# Altium project 003.sensor.PrjPcb
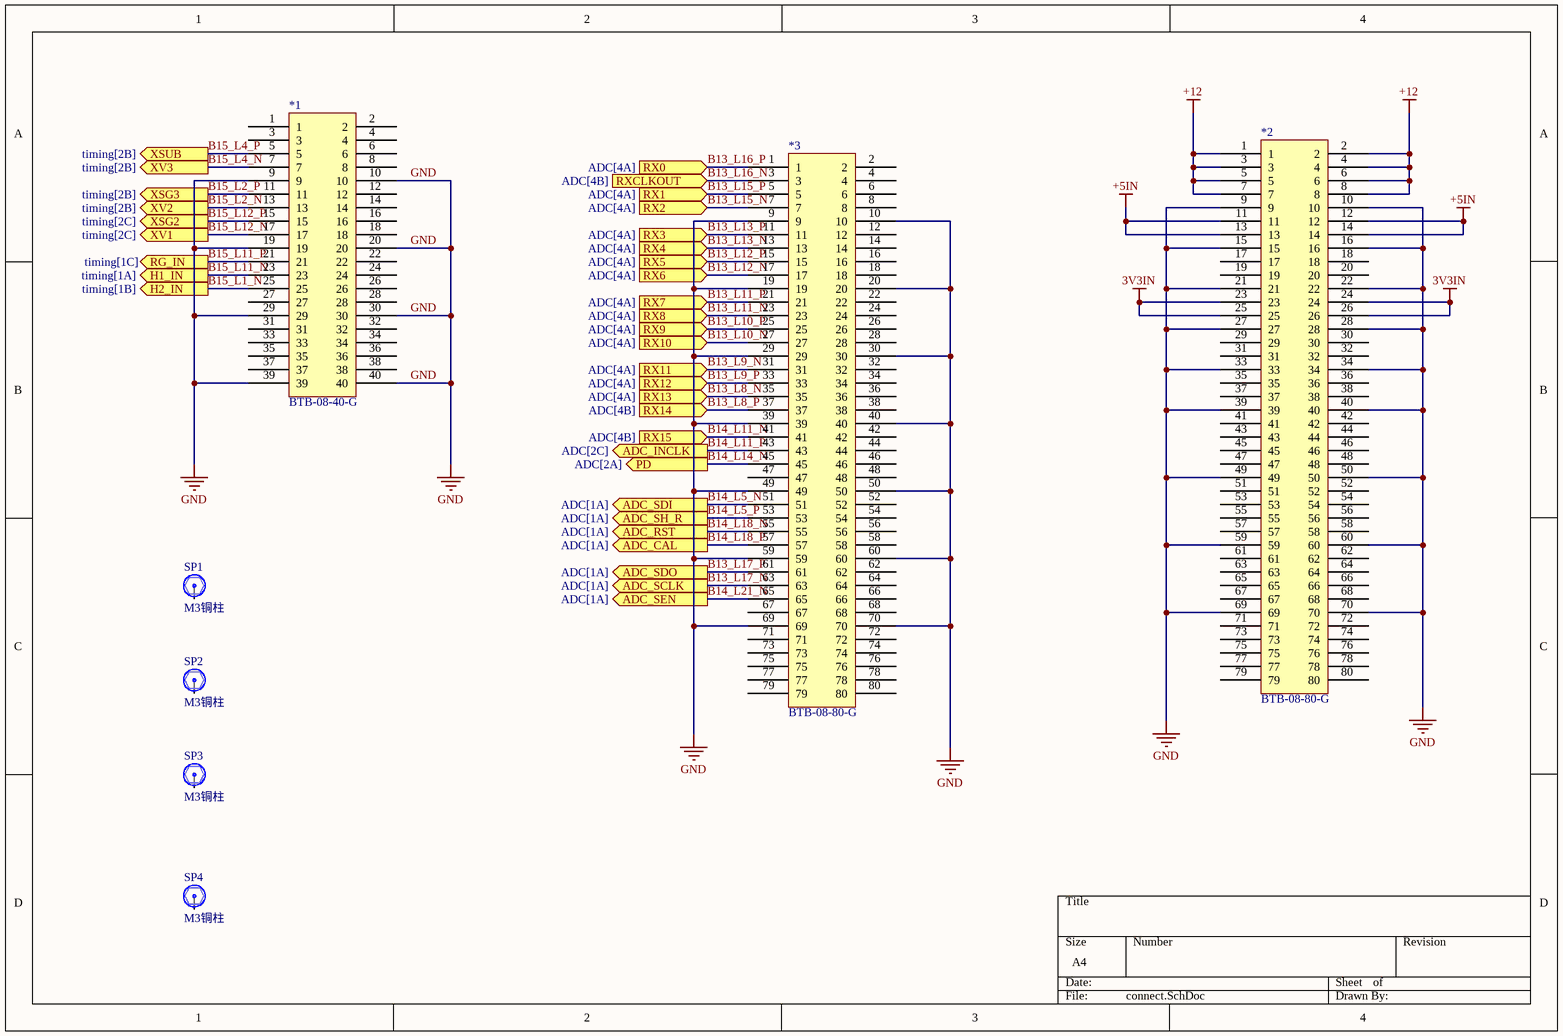
[diagram p0: connect.SchDoc]
5 sheets, 159 parts. Net scope: flat (ports and power ports of the same name join across sheets).
Board files: PCB2.PcbDoc, PCB1.PcbDoc
Sheets:
  connect.SchDoc
  power.SchDoc
  ADC.SchDoc
  CCD.SchDoc
  timing.SchDoc

## Sheet connect.SchDoc
size A4; SheetNumber: 1; SheetTotal: 5

### Parts
*1  BTB-08-40-G  [BTB-08-40-M]
*2  BTB-08-80-G  [BTB-08-80-G]
*3  BTB-08-80-G  [BTB-08-80-G]
SP1  M3铜柱  [M3x5_N]
SP2  M3铜柱  [M3x5_N]
SP3  M3铜柱  [M3x5_N]
SP4  M3铜柱  [M3x5_N]

### Ports
ADC_CAL (out, see ADC[1A]), ADC_INCLK (out, see ADC[2C]), ADC_RST (out, see ADC[1A]), ADC_SCLK (out, see ADC[1A]), ADC_SDI (out, see ADC[1A]), ADC_SDO (out, see ADC[1A]), ADC_SEN (out, see ADC[1A]), ADC_SH_R (out, see ADC[1A]), H1_IN (out, see timing[1A]), H2_IN (out, see timing[1B]), PD (out, see ADC[2A]), RG_IN (out, see timing[1C]), RX0 (in, see ADC[4A]), RX1 (in, see ADC[4A]), RX2 (in, see ADC[4A]), RX3 (in, see ADC[4A]), RX4 (in, see ADC[4A]), RX5 (in, see ADC[4A]), RX6 (in, see ADC[4A]), RX7 (in, see ADC[4A]), RX8 (in, see ADC[4A]), RX9 (in, see ADC[4A]), RX10 (in, see ADC[4A]), RX11 (in, see ADC[4A]), RX12 (in, see ADC[4A]), RX13 (in, see ADC[4A]), RX14 (in, see ADC[4B]), RX15 (in, see ADC[4B]), RXCLKOUT (in, see ADC[4B]), XSG2 (out, see timing[2C]), XSG3 (out, see timing[2B]), XSUB (out, see timing[2B]), XV1 (out, see timing[2C]), XV2 (out, see timing[2B]), XV3 (out, see timing[2B])

### Nets
3V3IN: *2.23 *2.24 *2.25 *2.26
+5IN: *2.11 *2.12 *2.13 *2.14
+12: *2.1 *2.2 *2.3 *2.4 *2.5 *2.6 *2.7 *2.8
GND: *1.9 *1.10 *1.19 *1.20 *1.29 *1.30 *1.39 *1.40 *2.9 *2.10 *2.15 *2.16 *2.21 *2.22 *2.27 *2.28 *2.33 *2.34 *2.39 *2.40 *2.49 *2.50 *2.59 *2.60 *2.69 *2.70 *3.9 *3.10 *3.19 *3.20 *3.29 *3.30 *3.39 *3.40 *3.49 *3.50 *3.59 *3.60 *3.69 *3.70
B13_L8_N: *3.35 ; port RX13
B13_L8_P: *3.37 ; port RX14
B13_L9_N: *3.31 ; port RX11
B13_L9_P: *3.33 ; port RX12
B13_L10_N: *3.27 ; port RX10
B13_L10_P: *3.25 ; port RX9
B13_L11_N: *3.23 ; port RX8
B13_L11_P: *3.21 ; port RX7
B13_L12_N: *3.17 ; port RX6
B13_L12_P: *3.15 ; port RX5
B13_L13_N: *3.13 ; port RX4
B13_L13_P: *3.11 ; port RX3
B13_L15_N: *3.7 ; port RX2
B13_L15_P: *3.5 ; port RX1
B13_L16_N: *3.3 ; port RXCLKOUT
B13_L16_P: *3.1 ; port RX0
B13_L17_N: *3.63 ; port ADC_SCLK  [project net ADC_SCLK]
B13_L17_P: *3.61 ; port ADC_SDO  [project net ADC_SDO]
B14_L5_N: *3.51 ; port ADC_SDI  [project net ADC_SDI]
B14_L5_P: *3.53 ; port ADC_SH_R  [project net ADC_SH_R]
B14_L11_N: *3.41 ; port RX15
B14_L11_P: *3.43 ; port ADC_INCLK  [project net ADC_INCLK]
B14_L14_N: *3.45 ; port PD
B14_L18_N: *3.55 ; port ADC_RST  [project net ADC_RST]
B14_L18_P: *3.57 ; port ADC_CAL  [project net ADC_CAL]
B14_L21_N: *3.65 ; port ADC_SEN  [project net ADC_SEN]
B15_L1_N: *1.25 ; port H2_IN
B15_L2_N: *1.13 ; port XV2
B15_L2_P: *1.11 ; port XSG3
B15_L4_N: *1.7 ; port XV3
B15_L4_P: *1.5 ; port XSUB
B15_L11_N: *1.23 ; port H1_IN
B15_L11_P: *1.21 ; port RG_IN
B15_L12_N: *1.17 ; port XV1
B15_L12_P: *1.15 ; port XSG2

Not connected (* = marked no-connect by the designer): *1 1 2 3 4 6 8 12 14 16 18 22 24 26 27 28 31 32 33 34 35 36 37 38; *2 17 18 19 20 29 30 31 32 35 36 37 38 41 42 43 44 45 46 47 48 51 52 53 54 55 56 57 58 61 62 63 64 65 66 67 68 71 72 73 74 75 76 77 78 79 80; *3 2 4 6 8 12 14 16 18 22 24 26 28 32 34 36 38 42 44 46 47 48 52 54 56 58 62 64 66 67 68 71 72 73 74 75 76 77 78 79 80; SP1 1; SP2 1; SP3 1; SP4 1

### Library data of the parts
SP1-SP4 = 铜柱大焊盘: 铜柱; 版权归属: 封装库来自淘宝 ID：黄晶宝石; BOM名称: 铜柱; 学习资源: https://shop463601444.taobao.com

## Sheet power.SchDoc
size A4; SheetNumber: 2; SheetTotal: 5
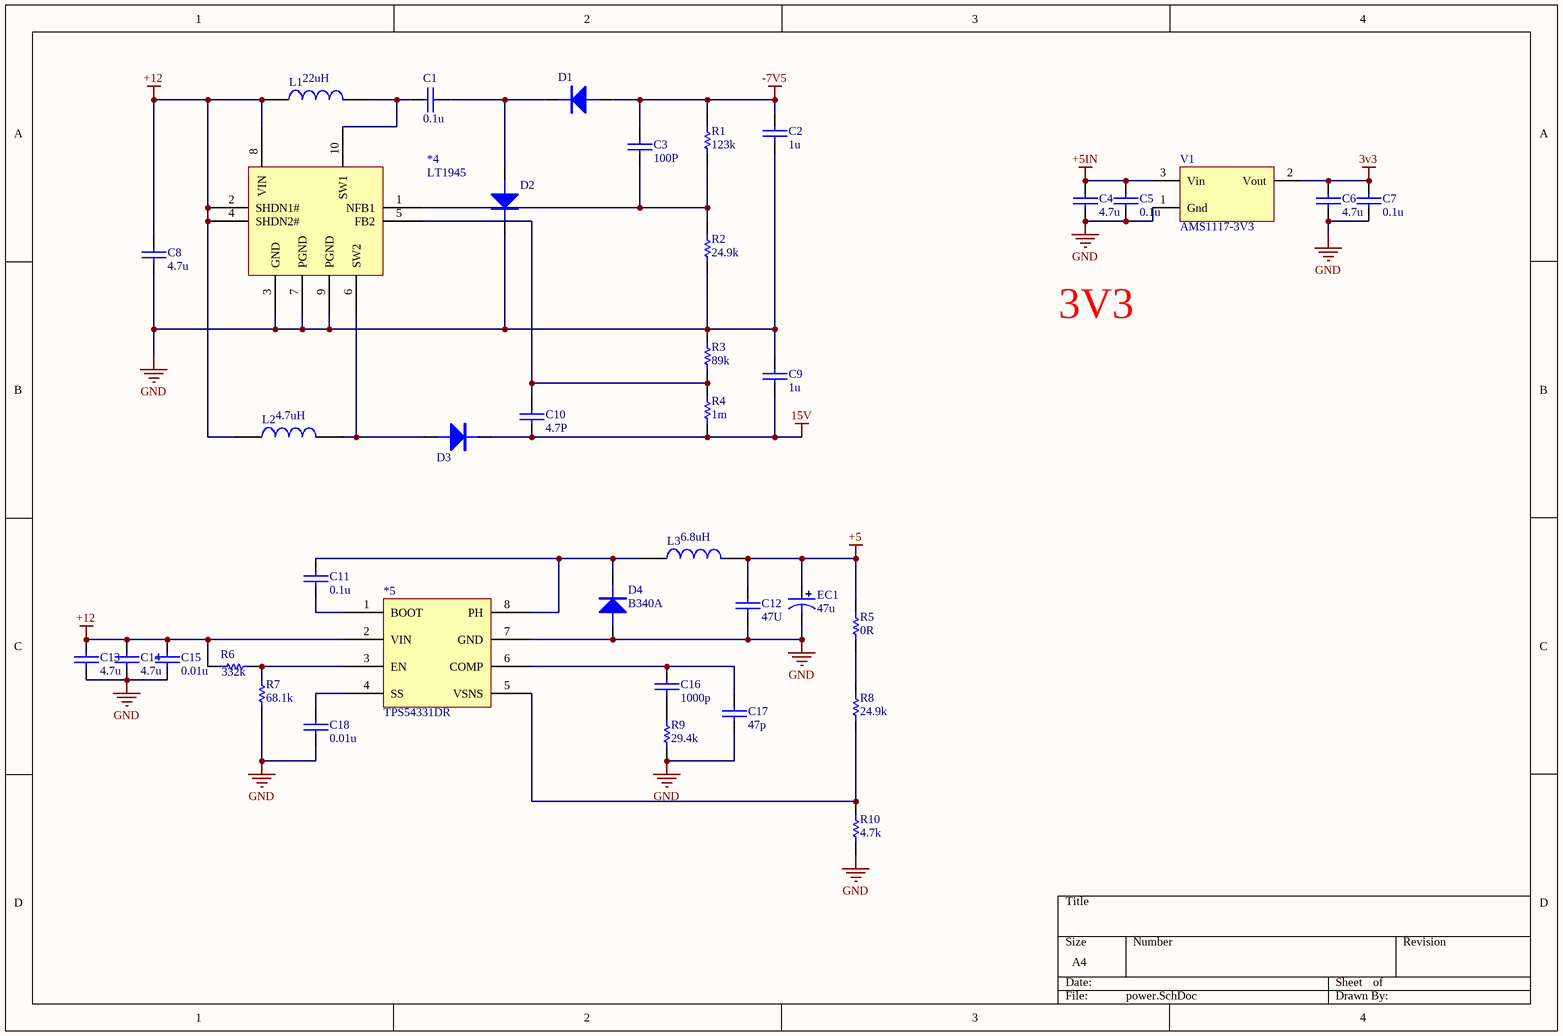
[diagram p1: power.SchDoc]

### Parts
*4  LT1945  [LT1945EMS]
*5  TPS54331DR  [SOIC-8]
C1  0.1u  [0603C]
C2  1u  [0603C]
C3  100P  [0603C]
C4  4.7u  [0603C]
C5  0.1u  [0603C]
C6  4.7u  [0603C]
C7  0.1u  [0603C]
C8  4.7u  [0603C]
C9  1u  [0603C]
C10  4.7P  [0603C]
C11  0.1u  [0603C]
C12  47U  [0603C]
C13  4.7u  [0603C]
C14  4.7u  [0603C]
C15  0.01u  [0603C]
C16  1000p  [0603C]
C17  47p  [0603C]
C18  0.01u  [0603C]
D1  B340A  [SMA/DO-214AC]  (value not drawn)
D2  B340A  [SMA/DO-214AC]  (value not drawn)
D3  B340A  [SMA/DO-214AC]  (value not drawn)
D4  B340A  [SMA/DO-214AC]
EC1  47u  [SMD-EC6.3X6.3X10]
L1  22uH  [L-SMD-0630]
L2  4.7uH  [L-SMD-0630]
L3  6.8uH  [L-SMD-0630]
R1  123k  [0603R]
R2  24.9k  [0603R]
R3  89k  [0603R]
R4  1m  [0603R]
R5  0R  [0603R]
R6  332k  [0603R]
R7  68.1k  [0603R]
R8  24.9k  [0603R]
R9  29.4k  [0603R]
R10  4.7k  [0603R]
V1  AMS1117-3V3  [SOT223_L]

### Nets
3v3: C6.2 C7.2 V1.2(Vout)
15V: C9.2 C10.2 D3.K R4.2
+5: C12.2 EC1.1 L3.2 R5.2
+5IN: C4.2 C5.2 V1.3(Vin)
+12: *4.2(SHDN1#) *4.4(SHDN2#) *4.8(VIN) *5.2(VIN) C8.1 C13.2 C14.2 C15.2 L1.1 L2.1 R6.2
-7V5: C2.1 C3.1 D1.A R1.2
GND: *4.3(GND) *4.7(PGND) *4.9(PGND) *5.7(GND) C2.2 C4.1 C5.1 C6.1 C7.1 C8.2 C9.1 C12.1 C13.1 C14.1 C15.1 C17.1 C18.1 D2.K D4.A EC1.2 R2.1 R3.2 R7.1 R9.1 R10.1 V1.1(Gnd)
Net*4_1: *4.1(NFB1) C3.2 R1.1 R2.2
Net*4_5: *4.5(FB2) C10.1 R3.1 R4.1
Net*4_6: *4.6(SW2) D3.A L2.2
Net*4_10: *4.10(SW1) C1.1 L1.2
Net*5_1: *5.1(BOOT) C11.1
Net*5_3: *5.3(EN) R6.1 R7.2
Net*5_4: *5.4(SS) C18.2
Net*5_5: *5.5(VSNS) R8.1 R10.2
Net*5_6: *5.6(COMP) C16.2 C17.2
Net*5_8: *5.8(PH) C11.2 D4.K L3.1
NetC1_2: C1.2 D1.K D2.A
NetC16_1: C16.1 R9.2
NetR5_1: R5.1 R8.2

### Notes on the sheet
- 3V3

### Library data of the parts
*4 = LT1945: 双通道升降压DCDC
*5 = TPS54331DR: 降压型DC-DC
C1-C18 = CAP: 无极性电容
D1-D4 = DIODE: 普通二极管
EC1 = ECAP: 贴片电解电容
L1-L3 = L: INDUCTOR
R1-R10 = RES: 电阻
V1 = AMS1117: LDO; BOM名称: 稳压芯片; 封装库来自淘宝卖家：黄晶宝石: 其他店铺购入的买家，请立即申请退款，本店现金奖励200~1000元

## Sheet ADC.SchDoc
size A4; SheetNumber: 3; SheetTotal: 5
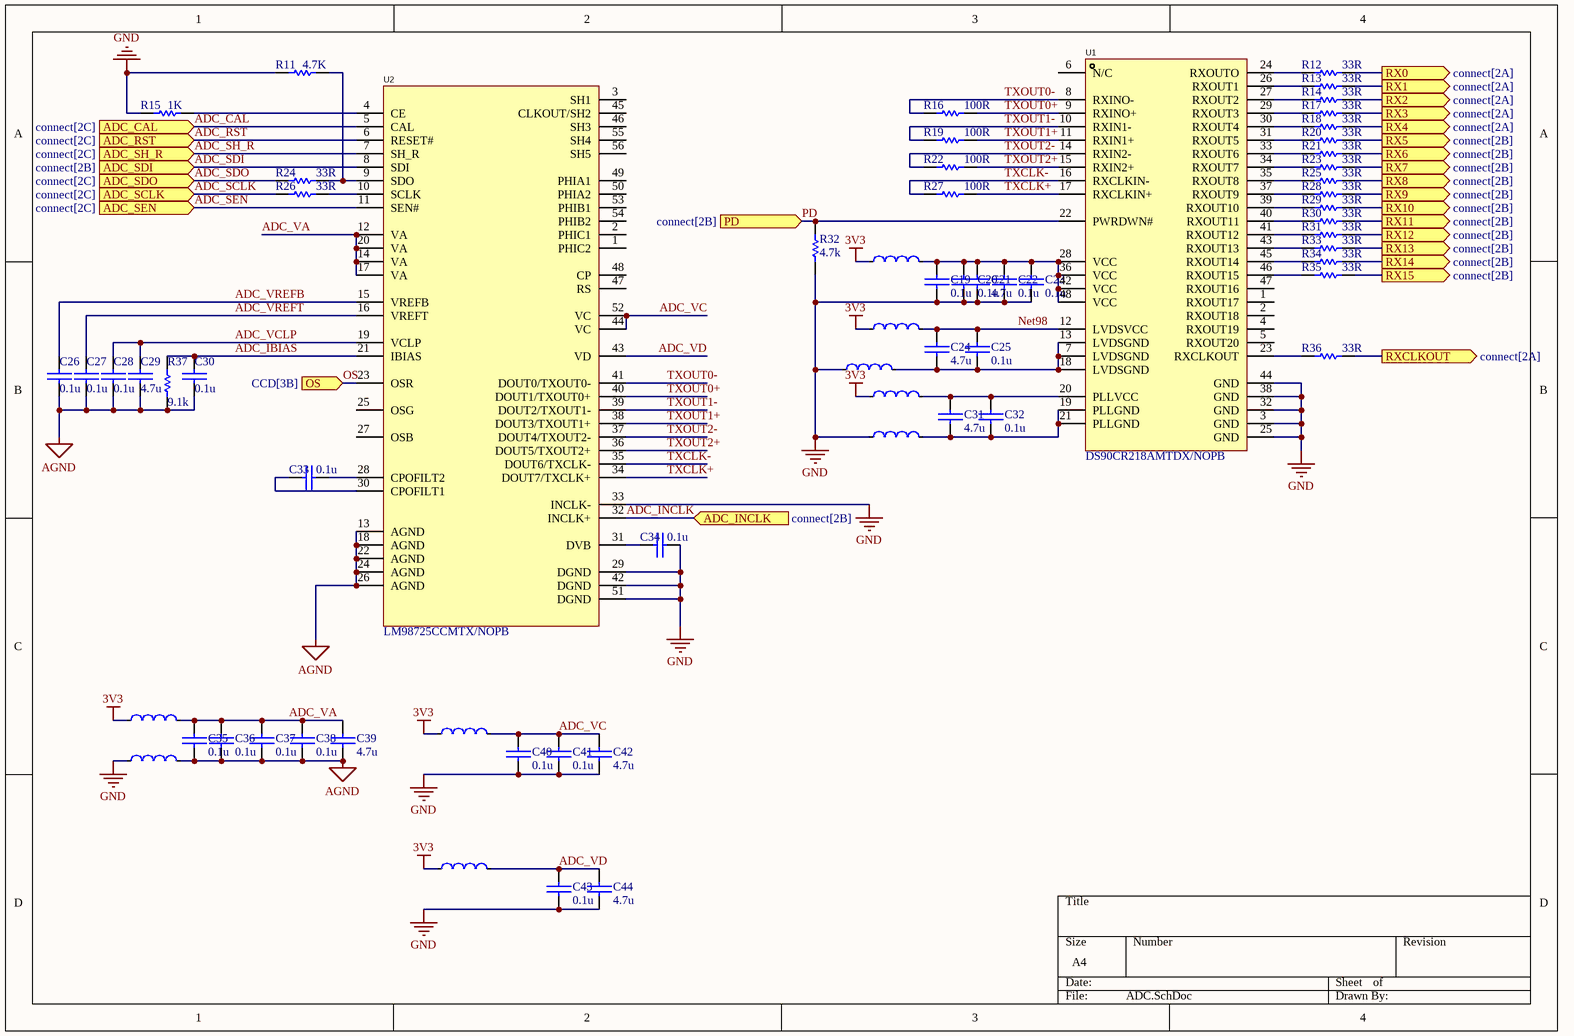
[diagram p2: ADC.SchDoc]

### Parts
C19  0.1u  [0603C]
C20  0.1u  [0603C]
C21  4.7u  [0603C]
C22  0.1u  [0603C]
C23  0.1u  [0603C]
C24  4.7u  [0603C]
C25  0.1u  [0603C]
C26  0.1u  [0603C]
C27  0.1u  [0603C]
C28  0.1u  [0603C]
C29  4.7u  [0603C]
C30  0.1u  [0603C]
C31  4.7u  [0603C]
C32  0.1u  [0603C]
C33  0.1u  [0603C]
C34  0.1u  [0603C]
C35  0.1u  [0603C]
C36  0.1u  [0603C]
C37  0.1u  [0603C]
C38  0.1u  [0603C]
C39  4.7u  [0603C]
C40  0.1u  [0603C]
C41  0.1u  [0603C]
C42  4.7u  [0603C]
C43  0.1u  [0603C]
C44  4.7u  [0603C]
L4  GZ1608D601TF  [0603L]  (value not drawn)
L5  GZ1608D601TF  [0603L]  (value not drawn)
L6  GZ1608D601TF  [0603L]  (value not drawn)
L7  GZ1608D601TF  [0603L]  (value not drawn)
L8  GZ1608D601TF  [0603L]  (value not drawn)
L9  GZ1608D601TF  [0603L]  (value not drawn)
L10  GZ1608D601TF  [0603L]  (value not drawn)
L11  GZ1608D601TF  [0603L]  (value not drawn)
L12  GZ1608D601TF  [0603L]  (value not drawn)
R11  4.7K  [0603R]
R12  33R  [0603R]
R13  33R  [0603R]
R14  33R  [0603R]
R15  1K  [0603R]
R16  100R  [0603R]
R17  33R  [0603R]
R18  33R  [0603R]
R19  100R  [0603R]
R20  33R  [0603R]
R21  33R  [0603R]
R22  100R  [0603R]
R23  33R  [0603R]
R24  33R  [0603R]
R25  33R  [0603R]
R26  33R  [0603R]
R27  100R  [0603R]
R28  33R  [0603R]
R29  33R  [0603R]
R30  33R  [0603R]
R31  33R  [0603R]
R32  4.7k  [0603R]
R33  33R  [0603R]
R34  33R  [0603R]
R35  33R  [0603R]
R36  33R  [0603R]
R37  9.1k  [0603R]
U1  DS90CR218AMTDX/NOPB  [TSSOP-48]
U2  LM98725CCMTX/NOPB  [TSSOP-56]

### Ports
ADC_CAL (in, see connect[2C]), ADC_INCLK (in, see connect[2B]), ADC_RST (in, see connect[2C]), ADC_SCLK (in, see connect[2C]), ADC_SDI (in, see connect[2B]), ADC_SDO (in, see connect[2C]), ADC_SEN (in, see connect[2C]), ADC_SH_R (in, see connect[2C]), OS (in, see CCD[3B]), PD (in, see connect[2B]), RX0 (out, see connect[2A]), RX1 (out, see connect[2A]), RX2 (out, see connect[2A]), RX3 (out, see connect[2A]), RX4 (out, see connect[2A]), RX5 (out, see connect[2B]), RX6 (out, see connect[2B]), RX7 (out, see connect[2B]), RX8 (out, see connect[2B]), RX9 (out, see connect[2B]), RX10 (out, see connect[2B]), RX11 (out, see connect[2B]), RX12 (out, see connect[2B]), RX13 (out, see connect[2B]), RX14 (out, see connect[2B]), RX15 (out, see connect[2B]), RXCLKOUT (out, see connect[2A])

### Nets
3v3: L4.1 L5.1 L7.1 L9.1 L10.1 L12.1
AGND: C26.2 C27.2 C28.2 C29.2 C30.2 C35.1 C36.1 C37.1 C38.1 C39.1 L11.2 R37.1 U2.13(AGND) U2.18(AGND) U2.22(AGND) U2.24(AGND) U2.26(AGND)
GND: C19.1 C20.1 C21.1 C22.1 C23.1 C34.2 C40.1 C41.1 C42.1 C43.1 C44.1 L6.1 L8.1 L11.1 R11.1 R15.1 R32.1 U1.3(GND) U1.25(GND) U1.32(GND) U1.38(GND) U1.44(GND) U2.29(DGND) U2.33(INCLK-) U2.42(DGND) U2.51(DGND)
ADC_CAL: U2.5(CAL) ; port ADC_CAL
ADC_IBIAS: C30.1 R37.2 U2.21(IBIAS)
ADC_INCLK: U2.32(INCLK+) ; port ADC_INCLK
ADC_RST: U2.6(RESET#) ; port ADC_RST
ADC_SCLK: R26.1 ; port ADC_SCLK
ADC_SDI: U2.8(SDI) ; port ADC_SDI
ADC_SDO: R24.1 ; port ADC_SDO
ADC_SEN: U2.11(SEN#) ; port ADC_SEN
ADC_SH_R: U2.7(SH_R) ; port ADC_SH_R
ADC_VA: C35.2 C36.2 C37.2 C38.2 C39.2 L9.2 U2.12(VA) U2.14(VA) U2.17(VA) U2.20(VA)
ADC_VC: C40.2 C41.2 C42.2 L10.2 U2.44(VC) U2.52(VC)
ADC_VCLP: C28.1 C29.1 U2.19(VCLP)
ADC_VD: C43.2 C44.2 L12.2 U2.43(VD)
ADC_VREFB: C26.1 U2.15(VREFB)
ADC_VREFT: C27.1 U2.16(VREFT)
B13_L8_N: R33.2 ; port RX13
B13_L8_P: R34.2 ; port RX14
B13_L9_N: R30.2 ; port RX11
B13_L9_P: R31.2 ; port RX12
B13_L10_N: R29.2 ; port RX10
B13_L10_P: R28.2 ; port RX9
B13_L11_N: R25.2 ; port RX8
B13_L11_P: R23.2 ; port RX7
B13_L12_N: R21.2 ; port RX6
B13_L12_P: R20.2 ; port RX5
B13_L13_N: R18.2 ; port RX4
B13_L13_P: R17.2 ; port RX3
B13_L15_N: R14.2 ; port RX2
B13_L15_P: R13.2 ; port RX1
B13_L16_N: R36.2 ; port RXCLKOUT
B13_L16_P: R12.2 ; port RX0
B14_L11_N: R35.2 ; port RX15
Net98: C24.2 C25.2 L5.2 U1.12(LVDSVCC)
OS: U2.23(OSR) ; port OS
PD: R32.2 U1.22(PWRDWN#) ; port PD  [project net B14_L14_N]
TXCLK+: R27.2 U1.17(RXCLKIN+) U2.34(DOUT7/TXCLK+)
TXCLK-: R27.1 U1.16(RXCLKIN-) U2.35(DOUT6/TXCLK-)
TXOUT0+: R16.2 U1.9(RXINO+) U2.40(DOUT1/TXOUT0+)
TXOUT0-: R16.1 U1.8(RXINO-) U2.41(DOUT0/TXOUT0-)
TXOUT1+: R19.2 U1.11(RXIN1+) U2.38(DOUT3/TXOUT1+)
TXOUT1-: R19.1 U1.10(RXIN1-) U2.39(DOUT2/TXOUT1-)
TXOUT2+: R22.2 U1.15(RXIN2+) U2.36(DOUT5/TXOUT2+)
TXOUT2-: R22.1 U1.14(RXIN2-) U2.37(DOUT4/TXOUT2-)
NetC19_2: C19.2 C20.2 C21.2 C22.2 C23.2 L4.2 U1.28(VCC) U1.36(VCC) U1.42(VCC) U1.48(VCC)
NetC24_1: C24.1 C25.1 L6.2 U1.7(LVDSGND) U1.13(LVDSGND) U1.18(LVDSGND)
NetC31_1: C31.1 C32.1 L8.2 U1.19(PLLGND) U1.21(PLLGND)
NetC31_2: C31.2 C32.2 L7.2 U1.20(PLLVCC)
NetC33_1: C33.1 U2.30(CPOFILT1)
NetC33_2: C33.2 U2.28(CPOFILT2)
NetC34_1: C34.1 U2.31(DVB)
NetR11_2: R11.2 R24.2 U2.9(SDO)
NetR12_1: R12.1 U1.24(RXOUTO)
NetR13_1: R13.1 U1.26(RXOUT1)
NetR14_1: R14.1 U1.27(RXOUT2)
NetR15_2: R15.2 U2.4(CE)
NetR17_1: R17.1 U1.29(RXOUT3)
NetR18_1: R18.1 U1.30(RXOUT4)
NetR20_1: R20.1 U1.31(RXOUT5)
NetR21_1: R21.1 U1.33(RXOUT6)
NetR23_1: R23.1 U1.34(RXOUT7)
NetR25_1: R25.1 U1.35(RXOUT8)
NetR26_2: R26.2 U2.10(SCLK)
NetR28_1: R28.1 U1.37(RXOUT9)
NetR29_1: R29.1 U1.39(RXOUT10)
NetR30_1: R30.1 U1.40(RXOUT11)
NetR31_1: R31.1 U1.41(RXOUT12)
NetR33_1: R33.1 U1.43(RXOUT13)
NetR34_1: R34.1 U1.45(RXOUT14)
NetR35_1: R35.1 U1.46(RXOUT15)
NetR36_1: R36.1 U1.23(RXCLKOUT)

Not connected (* = marked no-connect by the designer): U1 1(RXOUT17) 2(RXOUT18) 4(RXOUT19) 5(RXOUT20) 6(N/C) 47(RXOUT16); U2 1(PHIC2) 2(PHIC1) 3(SH1) 25(OSG) 27(OSB) 45(CLKOUT/SH2) 46(SH3) 47(RS) 48(CP) 49(PHIA1) 50(PHIA2) 53(PHIB1) 54(PHIB2) 55(SH4) 56(SH5)

### Library data of the parts
C19-C44 = CAP: 无极性电容
L4-L12 = FB: 铁氧体磁珠; Manufacturer: Sunlord(顺络); Add into BOM: yes; Impedance @ Frequency: 600Ω@100MHz; Tolerance: ±25%; DC Resistance: 450mΩ; Current Rating: 200mA; Circuits: 1; Name: GZ1608D601TF; Symbol: GZ1608D601TF; Device: GZ1608D601TF; LCSC Part Name: 600Ω@100MHz ±25%; Supplier Part: C1002; Manufacturer Part: GZ1608D601TF; Supplier Footprint: 0603; JLCPCB Part Class: Basic Part; Datasheet: https://atta.szlcsc.com/upload/public/pdf/source/20210830/355EA7C0FAC5394FC0FE3F17C770C20A.pdf; Supplier: LCSC; Convert to PCB: yes
R11-R37 = RES: 电阻
U1 = DS90CR218AMTDX/NOPB: 解串芯片; Manufacturer: TI(德州仪器); Add into BOM: yes; Name: DS90CR218AMTDX/NOPB; Symbol: DS90CR218AMTDX/NOPB; Device: DS90CR218AMTDX/NOPB; LCSC Part Name: DS90CR218AMTDX/NOPB; Supplier Part: C2674207; Manufacturer Part: DS90CR218AMTDX/NOPB; Supplier Footprint: TSSOP-48; JLCPCB Part Class: Extended Part; Supplier: LCSC; Convert to PCB: yes
U2 = LM98725CCMTX/NOPB: CCD专用ADC; Manufacturer: TI(德州仪器); Add into BOM: yes; Name: LM98725CCMTX/NOPB; Symbol: LM98725CCMTX/NOPB; Device: LM98725CCMTX/NOPB; LCSC Part Name: LM98725CCMTX/NOPB; Supplier Part: C2679405; Manufacturer Part: LM98725CCMTX/NOPB; Supplier Footprint: TSSOP-56; JLCPCB Part Class: Extended Part; Supplier: LCSC; Convert to PCB: yes

## Sheet CCD.SchDoc
size A4; SheetNumber: 4; SheetTotal: 5
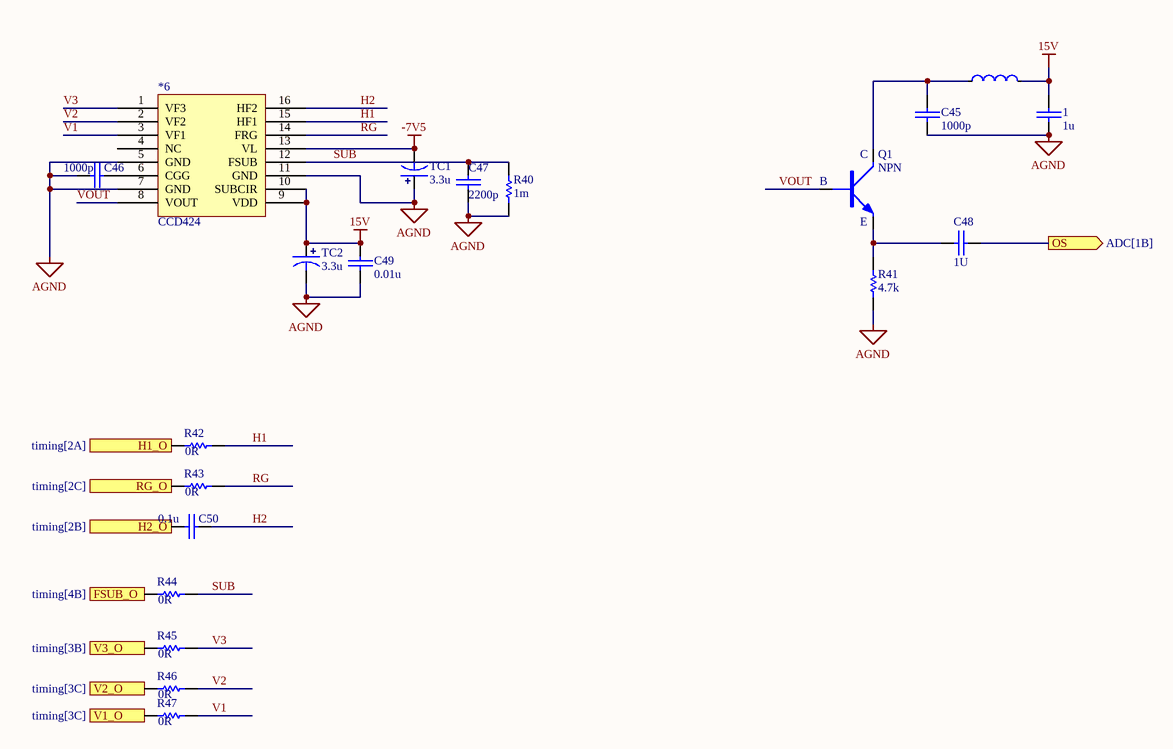
[diagram p3: CCD.SchDoc]

### Parts
1  1u  [0603C]
*6  CCD424  [CCD424]
C45  1000p  [0603C]
C46  1000p  [0603C]
C47  2200p  [0603C]
C48  1U  [0603C]
C49  0.01u  [0603C]
C50  0.1u  [0603C]
L13  GZ1608D601TF  [0603L]  (value not drawn)
Q1  NPN  [SOT23-3]
R40  1m  [0603R]
R41  4.7k  [0603R]
R42  0R  [0603R]
R43  0R  [0603R]
R44  0R  [0603R]
R45  0R  [0603R]
R46  0R  [0603R]
R47  0R  [0603R]
TC1  3.3u  [TAJ-A/3216]
TC2  3.3u  [TAJ-A/3216]

### Ports
FSUB_O (in, see timing[4B]), H1_O (in, see timing[2A]), H2_O (in, see timing[2B]), OS (out, see ADC[1B]), RG_O (in, see timing[2C]), V1_O (in, see timing[3C]), V2_O (in, see timing[3C]), V3_O (in, see timing[3B])

### Nets
15V: 1.2 *6.9(VDD) *6.10(SUBCIR) C49.2 L13.2 TC2.1
-7V5: *6.13(VL) TC1.2
AGND: 1.1 *6.5(GND) *6.7(GND) *6.11(GND) C45.1 C46.2 C47.1 C49.1 R40.1 R41.1 TC1.1 TC2.2
H1: *6.15(HF1) R42.1
H2: *6.16(HF2) C50.1
OS: C48.1 ; port OS
RG: *6.14(FRG) R43.1
SUB: *6.12(FSUB) C47.2 R40.2 R44.1
V1: *6.3(VF1) R47.1
V2: *6.2(VF2) R46.1
V3: *6.1(VF3) R45.1
VOUT: *6.8(VOUT) Q1.1(B)
Net*6_6: *6.6(CGG) C46.1
Net*7_12: R47.2 ; port V1_O
Net*7_14: R46.2 ; port V2_O
Net*7_17: R45.2 ; port V3_O
NetC45_2: C45.2 L13.1 Q1.3(C)
NetC48_2: C48.2 Q1.2(E) R41.2
NetC50_2: C50.2 ; port H2_O
NetC53_1: R44.2 ; port FSUB_O
NetR42_2: R42.2 ; port H1_O
NetR43_2: R43.2 ; port RG_O

Not connected (* = marked no-connect by the designer): *6 4(NC)

### Library data of the parts
1 C45-C50 = CAP: 无极性电容
L13 = FB: as L4 on sheet ADC; Name: GZ1608D601TF; Symbol: GZ1608D601TF; Device: GZ1608D601TF; LCSC Part Name: 600Ω@100MHz ±25%; Supplier Part: C1002; Manufacturer Part: GZ1608D601TF; Supplier Footprint: 0603; JLCPCB Part Class: Basic Part; Datasheet: https://atta.szlcsc.com/upload/public/pdf/source/20210830/355EA7C0FAC5394FC0FE3F17C770C20A.pdf; Supplier: LCSC; Convert to PCB: yes
Q1 = NPN: NPN三极管
R40-R47 = RES: 电阻
TC1 TC2 = TCAP: 钽电容

## Sheet timing.SchDoc
size A4; SheetNumber: 5; SheetTotal: 5
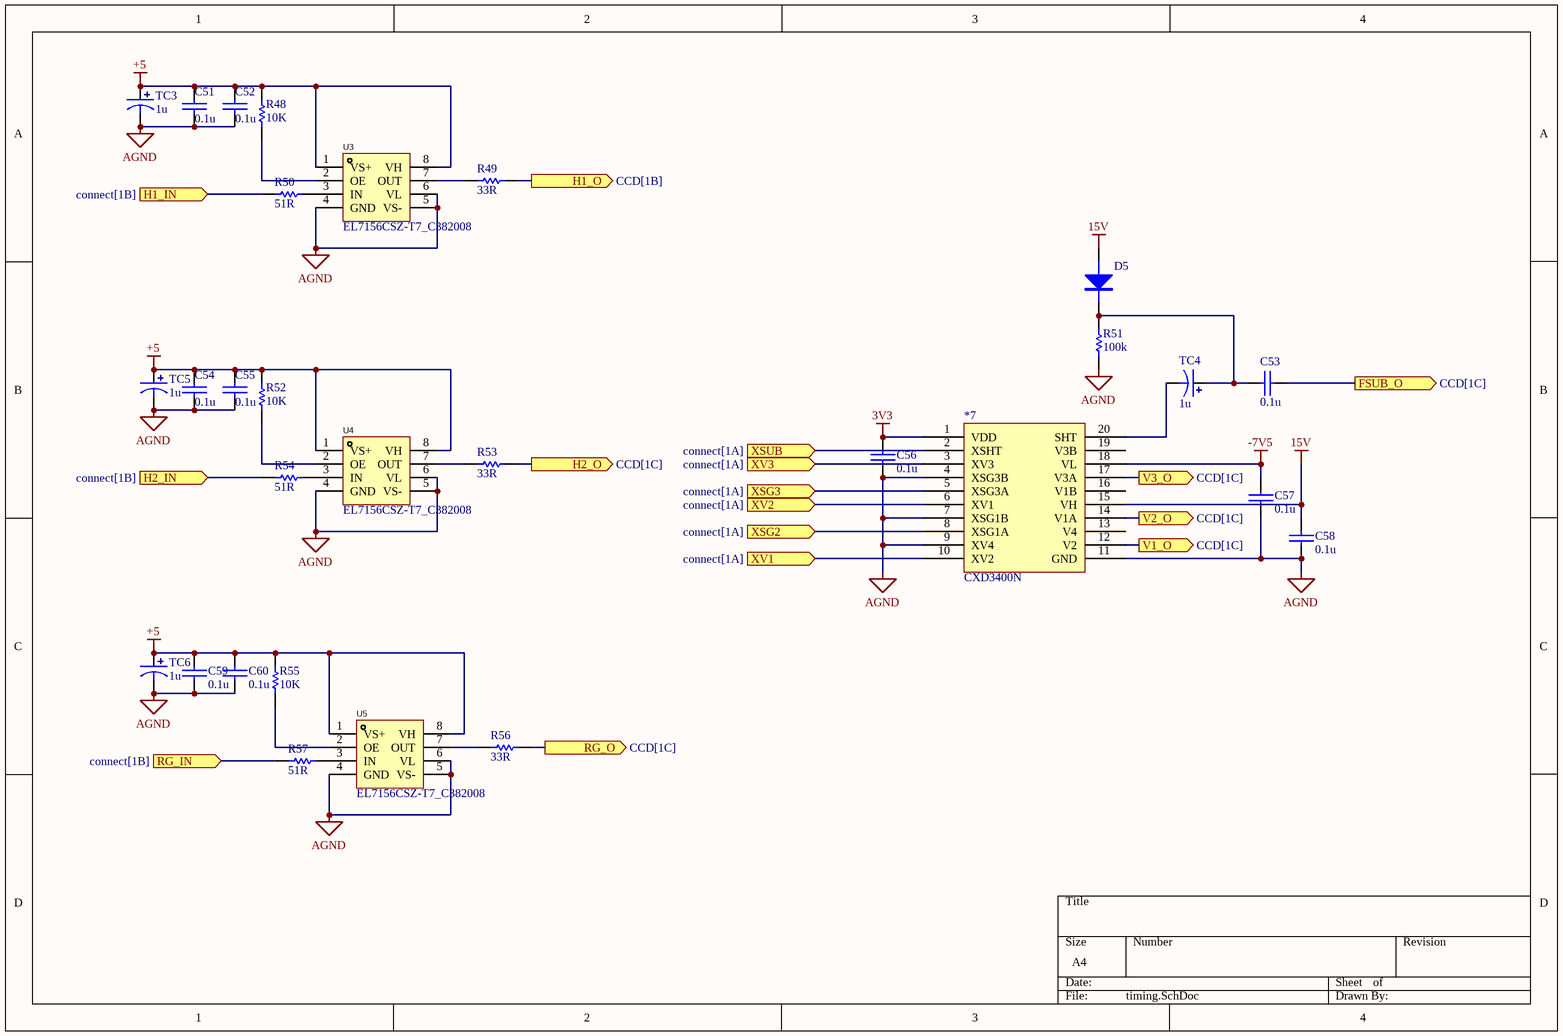
[diagram p4: timing.SchDoc]

### Parts
*7  CXD3400N  [CXD3400N]
C51  0.1u  [0603C]
C52  0.1u  [0603C]
C53  0.1u  [0603C]
C54  0.1u  [0603C]
C55  0.1u  [0603C]
C56  0.1u  [0603C]
C57  0.1u  [0603C]
C58  0.1u  [0603C]
C59  0.1u  [0603C]
C60  0.1u  [0603C]
D5  DIODE  [SMA/DO-214AC]  (value not drawn)
R48  10K  [0603R]
R49  33R  [0603R]
R50  51R  [0603R]
R51  100k  [0603R]
R52  10K  [0603R]
R53  33R  [0603R]
R54  51R  [0603R]
R55  10K  [0603R]
R56  33R  [0603R]
R57  51R  [0603R]
TC3  1u  [TAJ-A/3216]
TC4  1u  [TAJ-A/3216]
TC5  1u  [TAJ-A/3216]
TC6  1u  [TAJ-A/3216]
U3  EL7156CSZ-T7_C382008  [SOIC-8]
U4  EL7156CSZ-T7_C382008  [SOIC-8]
U5  EL7156CSZ-T7_C382008  [SOIC-8]

### Ports
FSUB_O (out, see CCD[1C]), H1_IN (in, see connect[1B]), H1_O (out, see CCD[1B]), H2_IN (in, see connect[1B]), H2_O (out, see CCD[1C]), RG_IN (in, see connect[1B]), RG_O (out, see CCD[1C]), V1_O (out, see CCD[1C]), V2_O (out, see CCD[1C]), V3_O (out, see CCD[1C]), XSG2 (in, see connect[1A]), XSG3 (in, see connect[1A]), XSUB (in, see connect[1A]), XV1 (in, see connect[1A]), XV2 (in, see connect[1A]), XV3 (in, see connect[1A])

### Nets
3v3: *7.1(VDD) C56.2
15V: *7.15(VH) C58.2 D5.A
+5: C51.1 C52.1 C54.1 C55.1 C59.1 C60.1 R48.1 R52.1 R55.1 TC3.1 TC5.1 TC6.1 U3.1(VS+) U3.8(VH) U4.1(VS+) U4.8(VH) U5.1(VS+) U5.8(VH)
-7V5: *7.18(VL) C57.2
AGND: *7.4(XSG3B) *7.7(XSG1B) *7.9(XV4) *7.11(GND) C51.2 C52.2 C54.2 C55.2 C56.1 C57.1 C58.1 C59.2 C60.2 R51.1 TC3.2 TC5.2 TC6.2 U3.4(GND) U3.5(VS-) U3.6(VL) U4.4(GND) U4.5(VS-) U4.6(VL) U5.4(GND) U5.5(VS-) U5.6(VL)
B15_L1_N: R54.2 ; port H2_IN
B15_L2_N: *7.6(XV1) ; port XV2
B15_L2_P: *7.5(XSG3A) ; port XSG3
B15_L4_N: *7.3(XV3) ; port XV3
B15_L4_P: *7.2(XSHT) ; port XSUB
B15_L11_N: R50.2 ; port H1_IN
B15_L11_P: R57.2 ; port RG_IN
B15_L12_N: *7.10(XV2) ; port XV1
B15_L12_P: *7.8(XSG1A) ; port XSG2
Net*7_12: *7.12(V2) ; port V1_O
Net*7_14: *7.14(V1A) ; port V2_O
Net*7_17: *7.17(V3A) ; port V3_O
Net*7_20: *7.20(SHT) TC4.2
NetC50_2: R53.1 ; port H2_O
NetC53_1: C53.1 ; port FSUB_O
NetC53_2: C53.2 D5.K R51.2 TC4.1
NetR42_2: R49.1 ; port H1_O
NetR43_2: R56.1 ; port RG_O
NetR48_2: R48.2 U3.2(OE)
NetR49_2: R49.2 U3.7(OUT)
NetR50_1: R50.1 U3.3(IN)
NetR52_2: R52.2 U4.2(OE)
NetR53_2: R53.2 U4.7(OUT)
NetR54_1: R54.1 U4.3(IN)
NetR55_2: R55.2 U5.2(OE)
NetR56_2: R56.2 U5.7(OUT)
NetR57_1: R57.1 U5.3(IN)

Not connected (* = marked no-connect by the designer): *7 13(V4) 16(V1B) 19(V3B)

### Library data of the parts
*7 = CXD3400N: 6通道垂直时钟驱动器
C51-C60 = CAP: 无极性电容
D5 = DIODE: 普通二极管
R48-R57 = RES: 电阻
TC3-TC6 = TCAP: 钽电容
U3-U5 = EL7156CSZ-T7: 栅极驱动器; Manufacturer: Intersil(英特矽尔); Add into BOM: yes; Name: EL7156CSZ-T7; Symbol: EL7156CSZ-T7; Device: EL7156CSZ-T7_C382008; LCSC Part Name: EL7156CSZ-T7; Supplier Part: C382008; Manufacturer Part: EL7156CSZ-T7; Supplier Footprint: SOIC-8; JLCPCB Part Class: Extended Part; Datasheet: https://atta.szlcsc.com/upload/public/pdf/source/20190409/C382008_2839965C4C72C039364B6D8C7260FFBC.pdf; Supplier: LCSC; Convert to PCB: yes

## Nets that join several sheets
3v3: power (C6.2 C7.2 V1.2), ADC (6 pins), timing (*7.1 C56.2)
15V: power (C9.2 C10.2 D3.K R4.2), CCD (6 pins), timing (*7.15 C58.2 D5.A)
+5: power (C12.2 EC1.1 L3.2 R5.2), timing (18 pins)
+5IN: connect (*2.11 *2.12 *2.13 *2.14), power (C4.2 C5.2 V1.3)
+12: connect (8 pins), power (11 pins)
-7V5: power (C2.1 C3.1 D1.A R1.2), CCD (*6.13 TC1.2), timing (*7.18 C57.2)
AGND: ADC (17 pins), CCD (12 pins), timing (26 pins)
GND: connect (40 pins), power (26 pins), ADC (26 pins)
ADC_CAL: connect (*3.57), ADC (U2.5)
ADC_INCLK: connect (*3.43), ADC (U2.32)
ADC_RST: connect (*3.55), ADC (U2.6)
ADC_SCLK: connect (*3.63), ADC (R26.1)
ADC_SDI: connect (*3.51), ADC (U2.8)
ADC_SDO: connect (*3.61), ADC (R24.1)
ADC_SEN: connect (*3.65), ADC (U2.11)
ADC_SH_R: connect (*3.53), ADC (U2.7)
B13_L8_N: connect (*3.35), ADC (R33.2)
B13_L8_P: connect (*3.37), ADC (R34.2)
B13_L9_N: connect (*3.31), ADC (R30.2)
B13_L9_P: connect (*3.33), ADC (R31.2)
B13_L10_N: connect (*3.27), ADC (R29.2)
B13_L10_P: connect (*3.25), ADC (R28.2)
B13_L11_N: connect (*3.23), ADC (R25.2)
B13_L11_P: connect (*3.21), ADC (R23.2)
B13_L12_N: connect (*3.17), ADC (R21.2)
B13_L12_P: connect (*3.15), ADC (R20.2)
B13_L13_N: connect (*3.13), ADC (R18.2)
B13_L13_P: connect (*3.11), ADC (R17.2)
B13_L15_N: connect (*3.7), ADC (R14.2)
B13_L15_P: connect (*3.5), ADC (R13.2)
B13_L16_N: connect (*3.3), ADC (R36.2)
B13_L16_P: connect (*3.1), ADC (R12.2)
B14_L11_N: connect (*3.41), ADC (R35.2)
B14_L14_N: connect (*3.45), ADC (R32.2 U1.22)
B15_L1_N: connect (*1.25), timing (R54.2)
B15_L2_N: connect (*1.13), timing (*7.6)
B15_L2_P: connect (*1.11), timing (*7.5)
B15_L4_N: connect (*1.7), timing (*7.3)
B15_L4_P: connect (*1.5), timing (*7.2)
B15_L11_N: connect (*1.23), timing (R50.2)
B15_L11_P: connect (*1.21), timing (R57.2)
B15_L12_N: connect (*1.17), timing (*7.10)
B15_L12_P: connect (*1.15), timing (*7.8)
Net*7_12: CCD (R47.2), timing (*7.12)
Net*7_14: CCD (R46.2), timing (*7.14)
Net*7_17: CCD (R45.2), timing (*7.17)
NetC50_2: CCD (C50.2), timing (R53.1)
NetC53_1: CCD (R44.2), timing (C53.1)
NetR42_2: CCD (R42.2), timing (R49.1)
NetR43_2: CCD (R43.2), timing (R56.1)
OS: ADC (U2.23), CCD (C48.1)